# Altium schematic sheet BBB Headers.SchDoc: BBB Headers
size Tabloid; DocumentNumber: LM-003; Revision: 3.0; SheetNumber: 2; SheetTotal: 5
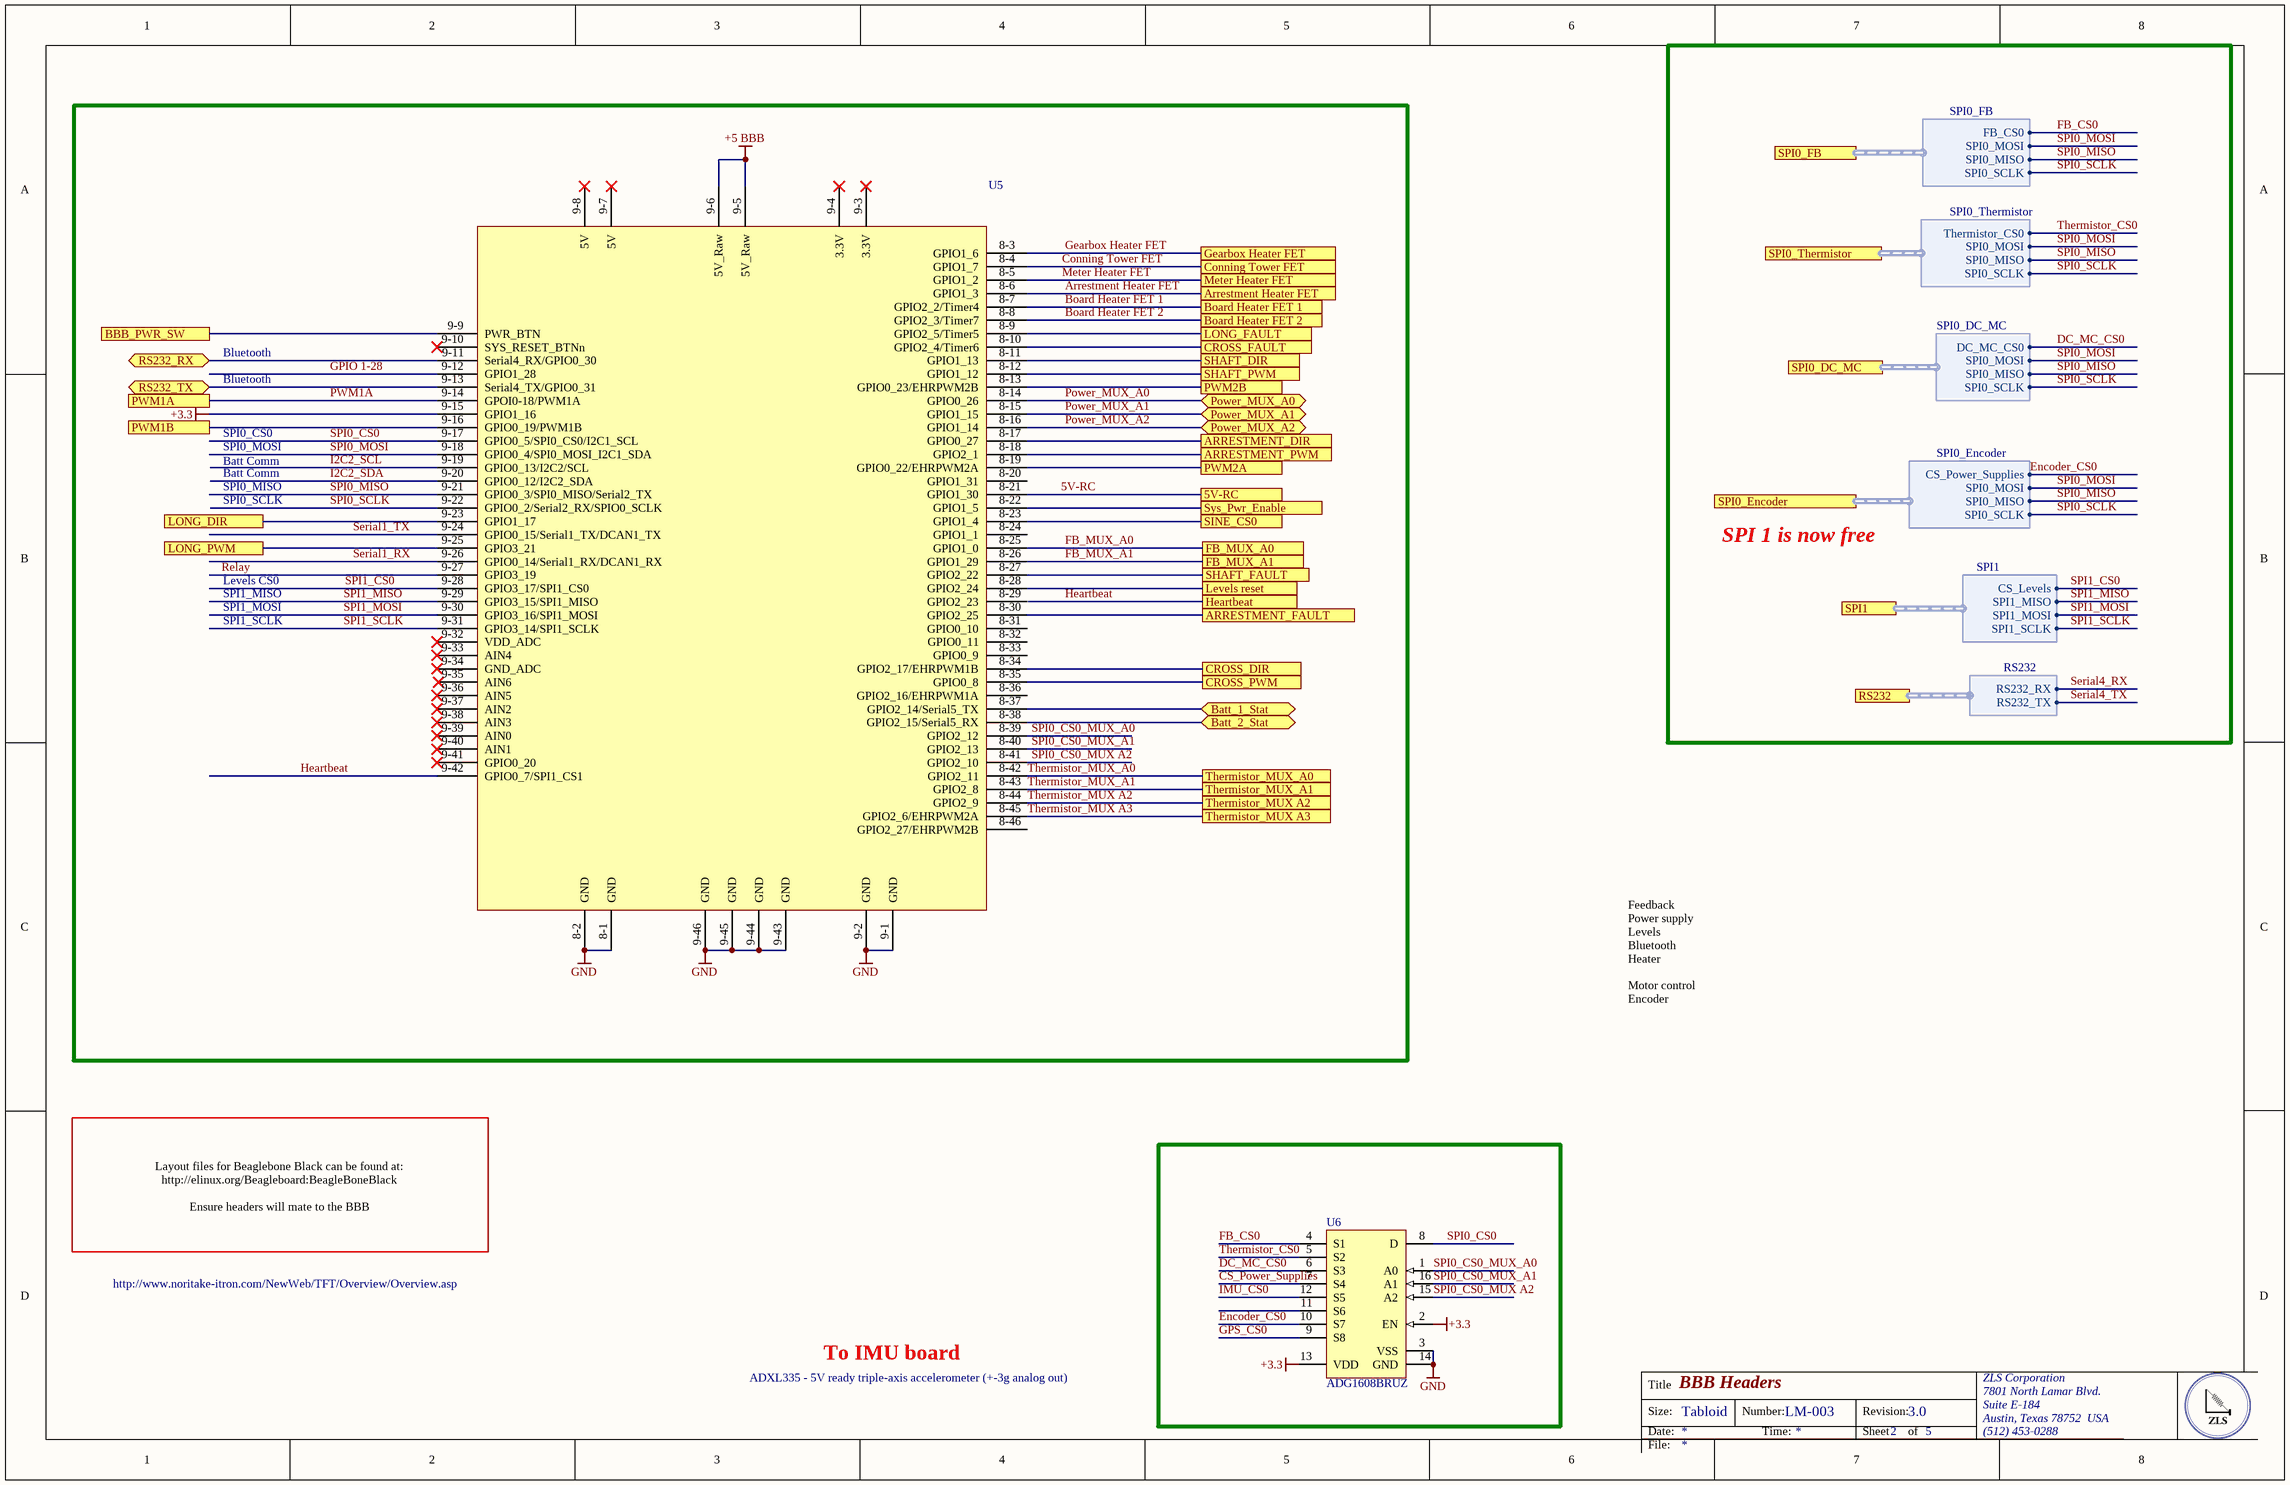
[diagram p0: BBB Headers.SchDoc]

## Parts
U5  BBB  [Beaglebone Black]  (value not drawn)
U6  ADG1608BRUZ  [ADI-RU-16_M]

## Ports
5V-RC, Arrestment Heater FET, ARRESTMENT_DIR, ARRESTMENT_FAULT, ARRESTMENT_PWM, Batt_1_Stat, Batt_2_Stat, BBB_PWR_SW, Board Heater FET 1, Board Heater FET 2, Conning Tower FET, CROSS_DIR, CROSS_FAULT, CROSS_PWM, FB_MUX_A0, FB_MUX_A1, Gearbox Heater FET, Heartbeat, Levels reset, LONG_DIR, LONG_FAULT, LONG_PWM, Meter Heater FET, Power_MUX_A0, Power_MUX_A1, Power_MUX_A2, PWM1A, PWM1B, PWM2A, PWM2B, RS232 (harness RS232), RS232_RX, RS232_TX, SHAFT_DIR, SHAFT_FAULT, SHAFT_PWM, SINE_CS0, SPI0_DC_MC (harness SPI0_DC_MC), SPI0_Encoder (harness SPI0_Encoder), SPI0_FB (harness SPI0_FB), SPI0_Thermistor (harness SPI0_Thermistor), SPI1 (harness SPI1), Sys_Pwr_Enable, Thermistor_MUX A2, Thermistor_MUX A3, Thermistor_MUX_A0, Thermistor_MUX_A1

## Harnesses
RS232: RS232_RX, RS232_TX
SPI1: CS_Levels, SPI1_MISO, SPI1_MOSI, SPI1_SCLK
SPI0_DC_MC: DC_MC_CS0, SPI0_MOSI, SPI0_MISO, SPI0_SCLK
SPI0_Encoder: CS_Power_Supplies, SPI0_MOSI, SPI0_MISO, SPI0_SCLK
SPI0_Thermistor: Thermistor_CS0, SPI0_MOSI, SPI0_MISO, SPI0_SCLK
SPI0_FB: FB_CS0, SPI0_MOSI, SPI0_MISO, SPI0_SCLK

## Nets
+3.3: U5.9-15(GPIO1_16) U6.2(EN) U6.13(VDD)
+5 BBB: U5.9-5(5V_Raw) U5.9-6(5V_Raw)
GND: U5.8-1(GND) U5.8-2(GND) U5.9-1(GND) U5.9-2(GND) U5.9-43(GND) U5.9-44(GND) U5.9-45(GND) U5.9-46(GND) U6.3(VSS) U6.14(GND)
5V-RC: U5.8-21(GPIO1_30) ; port 5V-RC
Arrestment Heater FET: U5.8-6(GPIO1_3) ; port Arrestment Heater FET
ARRESTMENT_DIR: U5.8-17(GPIO0_27) ; port ARRESTMENT_DIR
ARRESTMENT_FAULT: U5.8-30(GPIO2_25) ; port ARRESTMENT_FAULT
ARRESTMENT_PWM: U5.8-18(GPIO2_1) ; port ARRESTMENT_PWM
Batt_1_Stat: U5.8-37(GPIO2_14/Serial5_TX) ; port Batt_1_Stat
Batt_2_Stat: U5.8-38(GPIO2_15/Serial5_RX) ; port Batt_2_Stat
BBB_PWR_SW: U5.9-9(PWR_BTN) ; port BBB_PWR_SW
Board Heater FET 1: U5.8-7(GPIO2_2/Timer4) ; port Board Heater FET 1
Board Heater FET 2: U5.8-8(GPIO2_3/Timer7) ; port Board Heater FET 2
Conning Tower FET: U5.8-4(GPIO1_7) ; port Conning Tower FET
CROSS_DIR: U5.8-34(GPIO2_17/EHRPWM1B) ; port CROSS_DIR
CROSS_FAULT: U5.8-10(GPIO2_4/Timer6) ; port CROSS_FAULT
CROSS_PWM: U5.8-35(GPIO0_8) ; port CROSS_PWM
CS_Power_Supplies: U6.7(S4)
DC_MC_CS0: U6.6(S3) ; port SPI0_DC_MC.DC_MC_CS0
Encoder_CS0: U6.10(S7) ; port SPI0_Encoder.CS_Power_Supplies
FB_CS0: U6.4(S1) ; port SPI0_FB.FB_CS0
FB_MUX_A0: U5.8-25(GPIO1_0) ; port FB_MUX_A0
FB_MUX_A1: U5.8-26(GPIO1_29) ; port FB_MUX_A1
Gearbox Heater FET: U5.8-3(GPIO1_6) ; port Gearbox Heater FET
GPIO 1-28: U5.9-12(GPIO1_28)
GPS_CS0: U6.9(S8)
Heartbeat: U5.9-42(GPIO0_7/SPI1_CS1) ; port Heartbeat
I2C2_SCL: U5.9-19(GPIO0_13/I2C2/SCL)
I2C2_SDA: U5.9-20(GPIO0_12/I2C2_SDA)
IMU_CS0: U6.12(S5)
Levels reset: U5.8-28(GPIO2_24) ; port Levels reset
LONG_DIR: U5.9-23(GPIO1_17) ; port LONG_DIR
LONG_FAULT: U5.8-9(GPIO2_5/Timer5) ; port LONG_FAULT
LONG_PWM: U5.9-25(GPIO3_21) ; port LONG_PWM
Meter Heater FET: U5.8-5(GPIO1_2) ; port Meter Heater FET
Power_MUX_A0: U5.8-14(GPIO0_26) ; port Power_MUX_A0
Power_MUX_A1: U5.8-15(GPIO1_15) ; port Power_MUX_A1
Power_MUX_A2: U5.8-16(GPIO1_14) ; port Power_MUX_A2
PWM1A: U5.9-14(GPOI0-18/PWM1A) ; port PWM1A
PWM1B: U5.9-16(GPIO0_19/PWM1B) ; port PWM1B
PWM2A: U5.8-19(GPIO0_22/EHRPWM2A) ; port PWM2A
PWM2B: U5.8-13(GPIO0_23/EHRPWM2B) ; port PWM2B
Relay: U5.9-27(GPIO3_19)
RS232_RX: U5.9-11(Serial4_RX/GPIO0_30) ; port RS232_RX
RS232_TX: U5.9-13(Serial4_TX/GPIO0_31) ; port RS232_TX
Serial1_RX: U5.9-26(GPIO0_14/Serial1_RX/DCAN1_RX)
Serial1_TX: U5.9-24(GPIO0_15/Serial1_TX/DCAN1_TX)
Serial4_RX: port RS232.RS232_RX
Serial4_TX: port RS232.RS232_TX
SHAFT_DIR: U5.8-11(GPIO1_13) ; port SHAFT_DIR
SHAFT_FAULT: U5.8-27(GPIO2_22) ; port SHAFT_FAULT
SHAFT_PWM: U5.8-12(GPIO1_12) ; port SHAFT_PWM
SINE_CS0: U5.8-23(GPIO1_4) ; port SINE_CS0
SPI0_CS0: U5.9-17(GPIO0_5/SPI0_CS0/I2C1_SCL) U6.8(D)
SPI0_CS0_MUX A2: U5.8-41(GPIO2_10) U6.15(A2)
SPI0_CS0_MUX_A0: U5.8-39(GPIO2_12) U6.1(A0)
SPI0_CS0_MUX_A1: U5.8-40(GPIO2_13) U6.16(A1)
SPI0_MISO: U5.9-21(GPIO0_3/SPI0_MISO/Serial2_TX) ; port SPI0_DC_MC.SPI0_MISO, port SPI0_Encoder.SPI0_MISO, port SPI0_Thermistor.SPI0_MISO, port SPI0_FB.SPI0_MISO
SPI0_MOSI: U5.9-18(GPIO0_4/SPI0_MOSI_I2C1_SDA) ; port SPI0_DC_MC.SPI0_MOSI, port SPI0_Encoder.SPI0_MOSI, port SPI0_Thermistor.SPI0_MOSI, port SPI0_FB.SPI0_MOSI
SPI0_SCLK: U5.9-22(GPIO0_2/Serial2_RX/SPIO0_SCLK) ; port SPI0_DC_MC.SPI0_SCLK, port SPI0_Encoder.SPI0_SCLK, port SPI0_Thermistor.SPI0_SCLK, port SPI0_FB.SPI0_SCLK
SPI1_CS0: U5.9-28(GPIO3_17/SPI1_CS0) ; port SPI1.CS_Levels
SPI1_MISO: U5.9-29(GPIO3_15/SPI1_MISO) ; port SPI1.SPI1_MISO
SPI1_MOSI: U5.9-30(GPIO3_16/SPI1_MOSI) ; port SPI1.SPI1_MOSI
SPI1_SCLK: U5.9-31(GPIO3_14/SPI1_SCLK) ; port SPI1.SPI1_SCLK
Sys_Pwr_Enable: U5.8-22(GPIO1_5) ; port Sys_Pwr_Enable
Thermistor_CS0: U6.5(S2) ; port SPI0_Thermistor.Thermistor_CS0
Thermistor_MUX A2: U5.8-44(GPIO2_9) ; port Thermistor_MUX A2
Thermistor_MUX A3: U5.8-45(GPIO2_6/EHRPWM2A) ; port Thermistor_MUX A3
Thermistor_MUX_A0: U5.8-42(GPIO2_11) ; port Thermistor_MUX_A0
Thermistor_MUX_A1: U5.8-43(GPIO2_8) ; port Thermistor_MUX_A1

Not connected (* = marked no-connect by the designer): U5 8-20(GPIO1_31) 8-24(GPIO1_1) 8-29(GPIO2_23) 8-31(GPIO0_10) 8-32(GPIO0_11) 8-33(GPIO0_9) 8-36(GPIO2_16/EHRPWM1A) 8-46(GPIO2_27/EHRPWM2B) 9-3(3.3V)* 9-4(3.3V)* 9-7(5V)* 9-8(5V)* 9-10(SYS_RESET_BTNn)* 9-32(VDD_ADC)* 9-33(AIN4)* 9-34(GND_ADC)* 9-35(AIN6) 9-36(AIN5)* 9-37(AIN2)* 9-38(AIN3)* 9-39(AIN0)* 9-40(AIN1)* 9-41(GPIO0_20)*; U6 11(S6)

## Notes on the sheet
- Bluetooth
- SPI0_CS0
- SPI0_MISO
- SPI0_MOSI
- Batt Comm
- SPI0_SCLK
- SPI 1 is now free
- SPI1_MISO
- SPI1_SCLK
- Levels CS0
- SPI1_MOSI
- Feedback
  Power supply
  Levels
  Bluetooth
  Heater
  Motor control
  Encoder
- Layout files for Beaglebone Black can be found at:
  http://elinux.org/Beagleboard:BeagleBoneBlack
  Ensure headers will mate to the BBB
- http://www.noritake-itron.com/NewWeb/TFT/Overview/Overview.asp
- To IMU board
- ADXL335 - 5V ready triple-axis accelerometer (+-3g analog out)
- Title
- Size:
- Date:
- Tabloid
- Number:
- Time:
- Revision:
- Sheet
- of
- ZLS Corporation
- 7801 North Lamar Blvd.
- Suite E-184
- Austin, Texas 78752  USA
- (512) 453-0288
- File:

## Library data of the parts
U5 = Beaglebone_Black: Beaglebone Black; Manufacturer: Molex, LLC; Manufacturer Part Number: 0010897462; Connector Type: Header, Breakaway; Pitch - Mating: 0.100" (2.54mm); Style: Board to Board or Cable; Shrouding: Unshrouded; Number of Positions: 46; Number of Positions Loaded: All; Contact Length - Mating: 0.240" (6.10mm); Contact Length - Post: 0.107" (2.71mm); Overall Contact Length: 0.437" (11.10mm); Material Flammability Rating: UL94 V-0; Supplier 1: Digi-Key; Supplier Part Number 1: WM50012-46-ND; RoHS: RoHS Compliant; Category: Connectors, Interconnects; Stock 1: 407; Pricing 1: 1=7.65, 10=7.336, 25=6.698, 50=6.379, 100=6.0601, 250=5.4222, 500=5.10324 (USD); Packaging: Bulk; Part Status: Active; Contact Type: Male Pin; Number of Rows: 2; Row Spacing - Mating: 0.100" (2.54mm); Mounting Type: Through Hole; Termination: Solder; Fastening Type: -; Insulation Height: 0.090" (2.29mm); Contact Shape: Square; Contact Finish - Mating: Gold; Contact Finish Thickness - Mating: 15µin (0.38µm); Contact Finish - Post: Tin; Contact Material: Copper Alloy; Insulation Material: Liquid Crystal Polymer (LCP), Glass Filled; Features: -; Operating Temperature: -; Ingress Protection: -; Insulation Color: Black; Current Rating: -; Voltage Rating: -; Mated Stacking Heights: -; Contact Finish Thickness - Post: 74.8µin (1.90µm); Applications: Automotive, General Purpose, Lighting, Medical, Telecommunications; ComponentLink1URL: http://www.molex.com/pdm_docs/sd/010897041_sd.pdf; ComponentLink1Description: http://www.molex.com/pdm_docs/sd/010897041_sd.pdf
U6 = CMP-0793-00136-1: 4.5 Ohm Ron, 8-Channel +/-5 V,+12 V, +5 V and +3.3 V Multiplexer, 16-pin SOP (RU-16), Tube; Manufacturer: Analog Devices; Max Analog Signal Range: 0 to Vdd; Ron (ohms): 4.4; t transition (s): 150n; Bandwidth (Hz): 40M, 40M, 37M, 34M; Code_JEDEC: MO-153AB; PackageReference: RU-16; PackageDescription: 16-Pin Thin Shrink Small Outline Package, Body 5 x 4.4 mm, Pitch 0.65 mm; ComponentLink1Description: Manufacturer URL; ComponentLink2Description: Datasheet; PartNumber: ADG1608BRUZ; Mounting Technology: Surface Mount; PackageVersion: Nov-02; ComponentLink3Description: Package Specification; DatasheetVersion: Rev. 0; Packing: Tube; ComponentLink1URL: http://www.analog.com/en/index.html; ComponentLink3URL: http:/www.analog.com/static/imported-files/packages/36244347913743854010197452789RU16.pdf; ComponentLink2URL: http://www.analog.com/static/imported-files/data_sheets/ADG1608_1609.pdf